# Altium schematic sheet 4_SD_Card.SchDoc
size A4; Revision: 1.0; SheetNumber: 4; SheetTotal: 4
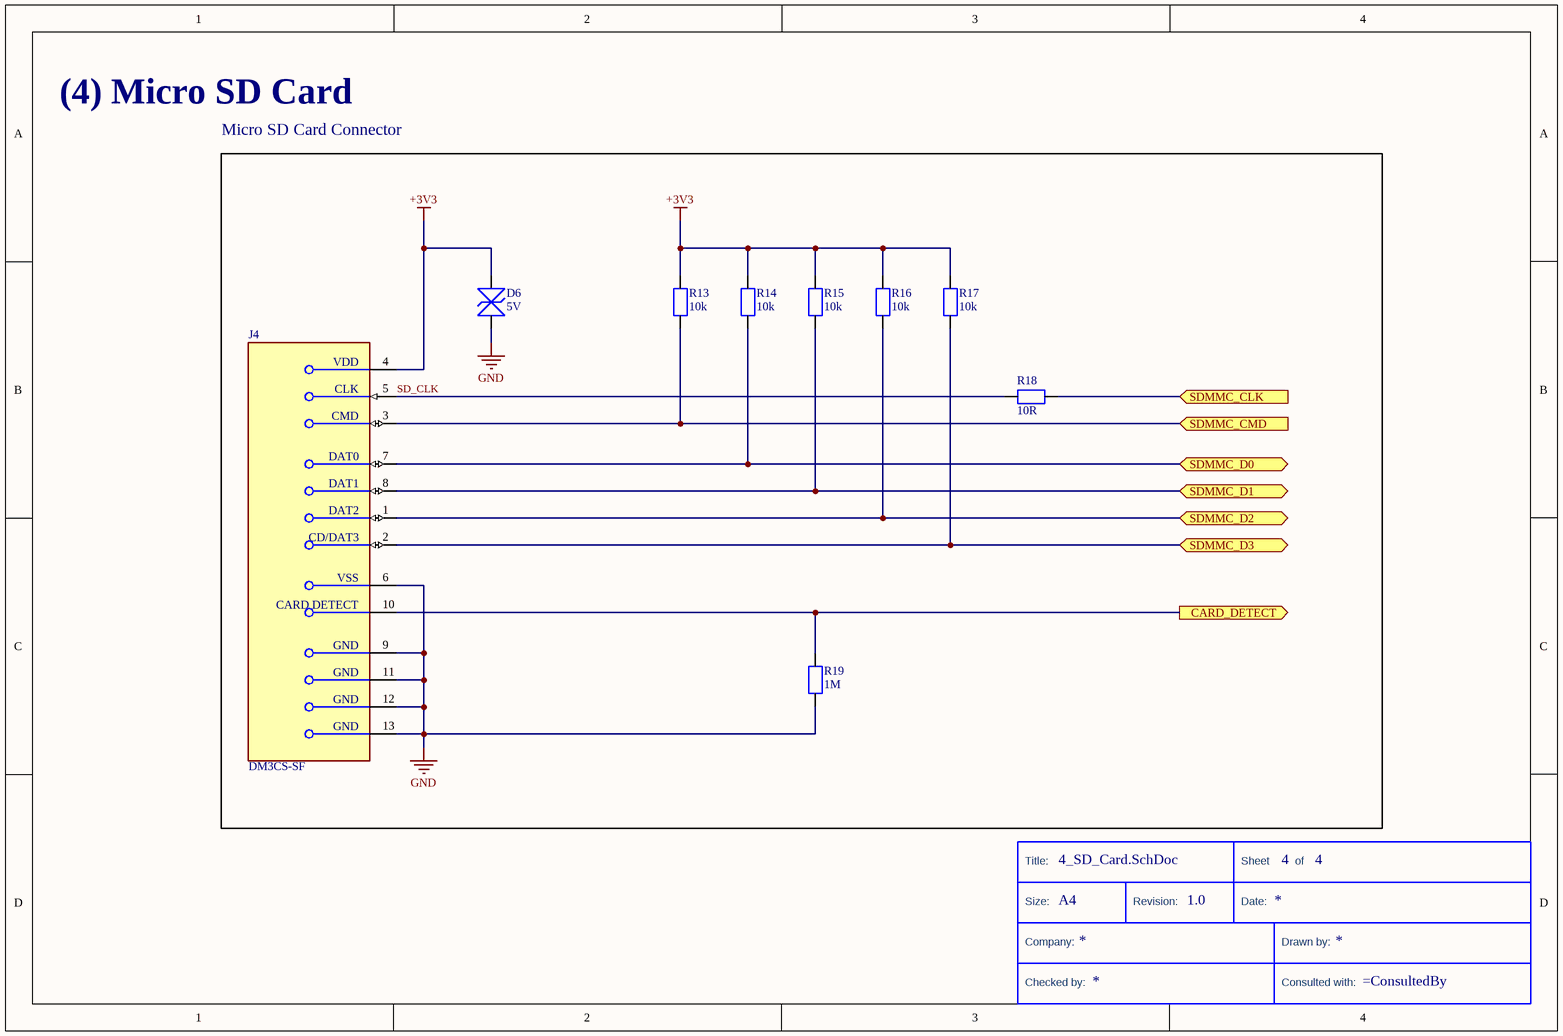
[diagram p0: 4_SD_Card.SchDoc]

## Parts
*  Size: A4  (hidden comment: TitleBlock)  (graphical)
D6  5V  [TVS_Littlefuse]
J4  DM3CS-SF  [FP-DM3CS-SF-MFG]
R13  10k  [RES_1206]
R14  10k  [RES_1206]
R15  10k  [RES_1206]
R16  10k  [RES_1206]
R17  10k  [RES_1206]
R18  10R  [RES_1206]
R19  1M  [RES_1206]

## Blocks framed on the sheet
Micro SD Card Connector: D6 J4 R13-R19

## Ports
CARD_DETECT (out), SDMMC_CLK (in), SDMMC_CMD (in), SDMMC_D0 (bidir), SDMMC_D1 (bidir), SDMMC_D2 (bidir), SDMMC_D3 (bidir)

## Nets
+3V3: D6.1 J4.4(VDD) R13.2 R14.2 R15.2 R16.2 R17.2
GND: D6.2 J4.6(VSS) J4.9(GND) J4.11(GND) J4.12(GND) J4.13(GND) R19.2
CARD_DETECT: J4.10(CARD_DETECT) R19.1 ; port CARD_DETECT
SD_CLK: J4.5(CLK) R18.2
SDMMC_CLK: R18.1 ; port SDMMC_CLK
SDMMC_CMD: J4.3(CMD) R13.1 ; port SDMMC_CMD
SDMMC_D0: J4.7(DAT0) R14.1 ; port SDMMC_D0
SDMMC_D1: J4.8(DAT1) R15.1 ; port SDMMC_D1
SDMMC_D2: J4.1(DAT2) R16.1 ; port SDMMC_D2
SDMMC_D3: J4.2(CD/DAT3) R17.1 ; port SDMMC_D3

## Notes on the sheet
- (4) Micro SD Card
- (in symbol TitleBlock) Title:; Sheet; of; Size:; Revision:; Date:; Company:; Drawn by:; Checked by:; Consulted with:

## Library data of the parts
* = TitleBlock: Standard Title Block
D6 = TVS_5V: TVS Diode TVS_SMAJ5.0CA  5V Bidirectional
J4 = CMP-11597-000003-1: CONN MICRO SD CARD HINGED TYPE; Pitch: 1.1mm; Connector Type: Connector; Current Rating: 500mA; Voltage Rating (AC): 125V; Gender: Female; Insulation Resistance: 1GR; Number of Positions: 8; Contact Resistance: 100mR; Packaging: Tape and Reel; Flammability Rating: UL94 V-0; Lead Free: Lead Free; Min Operating Temperature: -25°C; Orientation: Right Angle; Width: 13.8mm; Number of Rows: 1; Housing Material: Polymer; Package Quantity: 1; Mount: Surface Mount; Max Current Rating: 500mA; Radiation Hardening: No; Max Operating Temperature: 85°C; Contact Plating: Gold; Depth: 1.83mm; Contact Material: Gold; Length: 14.1mm; Number of Contacts: 8; Termination: Solder
R13-R19 = RES_1206: Generic 1206/3216 resistor